# Altium schematic sheet smoothieboard-alt-p3.SchDoc: =ProjectTitle
size B; Organization: Altium Limited; Address1: L3, 12a Rodborough Rd; Address2: Frenchs Forest; Address3: NSW; Address4: Australia 2086; DocumentNumber: 4; SheetNumber: 4; SheetTotal: 6
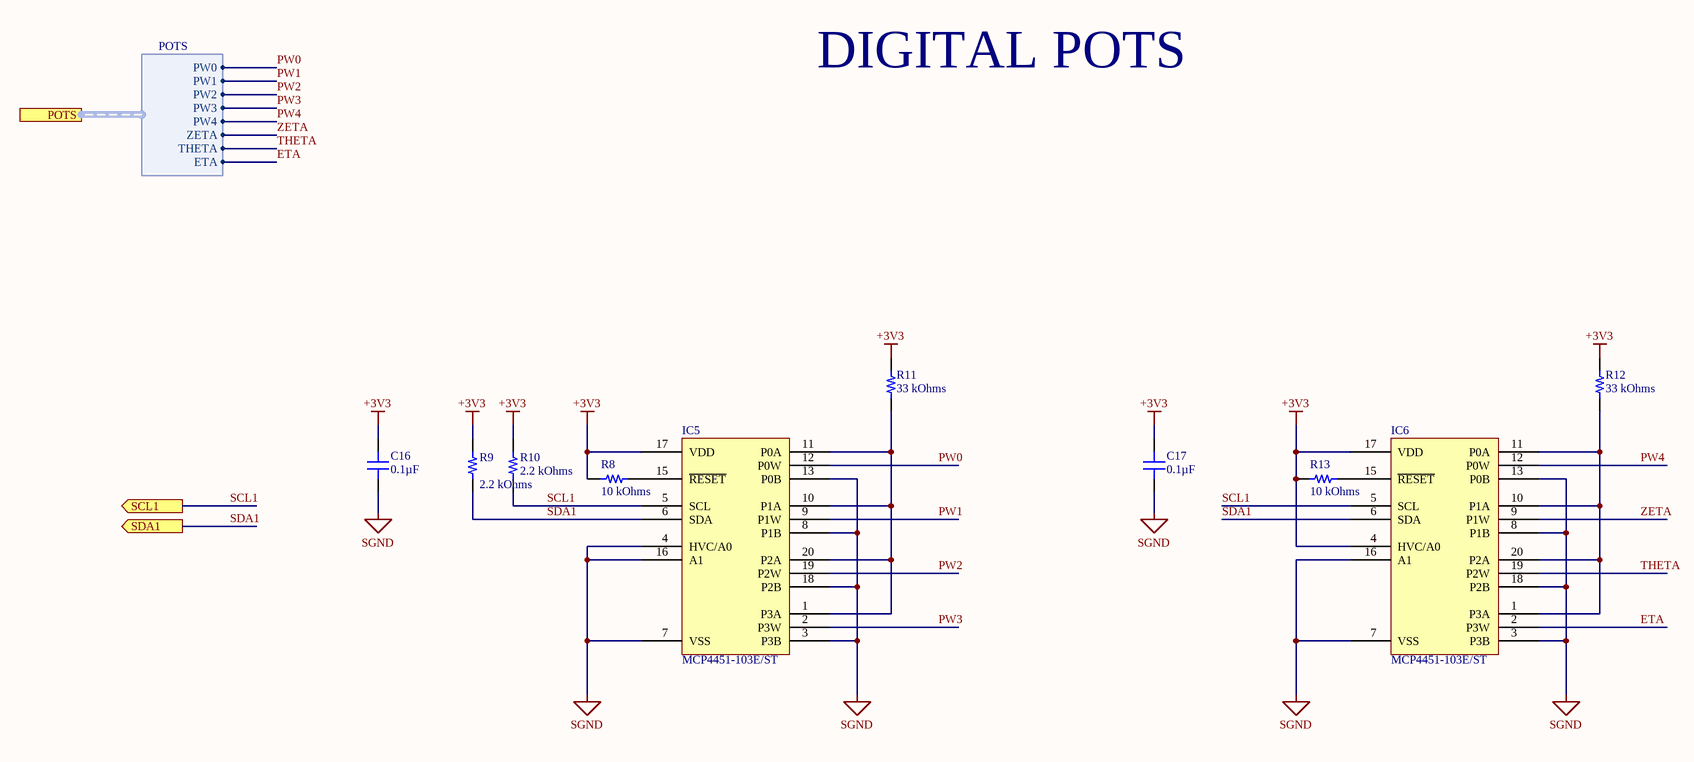
[diagram p0: smoothieboard-alt-p3.SchDoc]

## Parts
C16  0.1µF  [CAP 0402_1005]
C17  0.1µF  [CAP 0402_1005]
IC5  MCP4451-103E/ST  [MICROCHIP TSSOP-20 4.4MM BODY]
IC6  MCP4451-103E/ST  [MICROCHIP TSSOP-20 4.4MM BODY]
R8  10 kOhms  [RES 0402_1005]
R9  2.2 kOhms  [RES 0402_1005]
R10  2.2 kOhms  [RES 0402_1005]
R11  33 kOhms  [RES 0402_1005]
R12  33 kOhms  [RES 0402_1005]
R13  10 kOhms  [RES 0402_1005]

## Ports
POTS (harness POTS), SCL1 (out), SDA1 (out)

## Harnesses
POTS: PW0, PW1, PW2, PW3, PW4, ZETA, THETA, ETA

## Nets
+3V3: C16.2 C17.2 IC5.17(VDD) IC6.4(HVC/A0) IC6.17(VDD) R8.2 R9.2 R10.2 R11.2 R12.2 R13.2
SGND: C16.1 C17.1 IC5.3(P3B) IC5.4(HVC/A0) IC5.7(VSS) IC5.8(P1B) IC5.13(P0B) IC5.16(A1) IC5.18(P2B) IC6.3(P3B) IC6.7(VSS) IC6.8(P1B) IC6.13(P0B) IC6.16(A1) IC6.18(P2B)
ETA: IC6.2(P3W) ; port POTS.ETA
PW0: IC5.12(P0W) ; port POTS.PW0
PW1: IC5.9(P1W) ; port POTS.PW1
PW2: IC5.19(P2W) ; port POTS.PW2
PW3: IC5.2(P3W) ; port POTS.PW3
PW4: IC6.12(P0W) ; port POTS.PW4
SCL1: IC5.5(SCL) IC6.5(SCL) R10.1 ; port SCL1
SDA1: IC5.6(SDA) IC6.6(SDA) R9.1 ; port SDA1
THETA: IC6.19(P2W) ; port POTS.THETA
ZETA: IC6.9(P1W) ; port POTS.ZETA
NetIC5_1: IC5.1(P3A) IC5.10(P1A) IC5.11(P0A) IC5.20(P2A) R11.1
NetIC5_15: IC5.15(~{RESET}) R8.1
NetIC6_1: IC6.1(P3A) IC6.10(P1A) IC6.11(P0A) IC6.20(P2A) R12.1
NetIC6_15: IC6.15(~{RESET}) R13.1

## Notes on the sheet
- DIGITAL POTS
- Title
- Size:
- Date:
- B
- Number:
- Time:
- Revision:
- Sheet
- of
- File:

## Library data of the parts
C16 C17 = CC0402MRX5R5BB104: CAP CER 0.1UF 6.3V X5R 0402; Manufacturer: Yageo; Tolerance: ±20%; Part Number: CC0402MRX5R5BB104; Value: 0.1µF; Applications: General Purpose; Capacitance: 0.1µF; ComponentLink1Description: Datasheet; ComponentLink1URL: https://www.yageo.com/upload/media/product/productsearch/datasheet/mlcc/UPY-GPHC_X5R_4V-to-50V_25.pdf; ComponentLink2Description: DigiKey Link; ComponentLink2URL: http://digikey.com/product-detail/en/yageo/CC0402MRX5R5BB104/311-3818-1-ND/8024907; Device Package: 0402 (1005 Metric); LastUpdated: 9/2/2020 01:02:24; Lifecycle Status: Active; Minimum Order: 1; Mounting Type: Surface Mount, MLCC; Operating Temperature: -55°C ~ 85°C; Package / Case: 0402 (1005 Metric); Packaging: CutTape; PartId: 1960; Part Status: Active; Price: 0.10; Series: CC; Size / Dimension: 0.039" L x 0.020" W (1.00mm x 0.50mm); Supplier 1: DigiKey; Supplier Part Number 1: 311-3818-1-ND; Temperature Coefficient: X5R; Thickness (Max): 0.022" (0.55mm); Voltage - Rated: 6.3V
IC5 IC6 = MCP4451-103E/ST: IC DGT POT 10KOHM 257TAP 20TSSOP; Manufacturer: Microchip Technology; Configuration: Potentiometer; Interface: I²C; Memory Type: Volatile; Number of Circuits: 4; Number of Taps: 257; Resistance (Ohms): 10k; Resistance - Wiper (Ohms) (Typ): 75; Temperature Coefficient (Typ): 150ppm/°C; Tolerance: ±20%; Voltage - Supply: 1.8V ~ 5.5V; Part Number: MCP4451-103E/ST; ComponentLink1Description: Datasheet; ComponentLink1URL: http://www.microchip.com/mymicrochip/filehandler.aspx?ddocname=en551978; ComponentLink2Description: DigiKey Link; ComponentLink2URL: //digikey.com/product-detail/en/microchip-technology/MCP4451-103E-ST/MCP4451-103E-ST-ND/2601449; Device Package: 20-TSSOP (0.173", 4.40mm Width); Features: Mute, Selectable Address; LastUpdated: 12/4/2019 00:36:58; Lifecycle Status: 0; Minimum Order: 1; Operating Temperature: -40°C ~ 125°C; Package / Case: 20-TSSOP (0.173", 4.40mm Width); Packaging: Tube; PartId: 1; Part Status: Active; Price: 1.35; Series: -; Supplier 1: DigiKey; Supplier Part Number 1: MCP4451-103E/ST-ND; Supplier Device Package: 20-TSSOP; Taper: Linear
R8 R13 = CRCW040210K0JNTD: RES SMD 10K OHM 5% 1/16W 0402; Manufacturer: Vishay Dale; Power (Watts): 0.063W, 1/16W; Temperature Coefficient: ±200ppm/°C; Part Number: CRCW040210K0JNTD; Value: 10 kOhms; ComponentLink1Description: Datasheet; ComponentLink1URL: http://www.vishay.com/docs/20008/dcrcw.pdf; ComponentLink2Description: DigiKey Link; ComponentLink2URL: http://digikey.com/product-detail/en/vishay-dale/CRCW040210K0JNTD/541-CRCW040210K0JNTDCT-ND/11501263; Composition: Thick Film; Device Package: 0402 (1005 Metric); Features: Automotive AEC-Q200; LastUpdated: 9/2/2020 01:07:22; Lifecycle Status: Active; Minimum Order: 1; Number of Terminations: 2; Operating Temperature: -55°C ~ 155°C; Package / Case: 0402 (1005 Metric); Packaging: TapeAndReel; PartId: 56880; Price: 0.01; Ratings: AEC-Q200; Resistance: 10 kOhms; Series: CRCW; Supplier 1: DigiKey; Supplier Part Number 1: 541-CRCW040210K0JNTDCT-ND; Supplier Device Package: 0402; Tolerance: ±5%
R9 R10 = SR0402FR-7T2K2L: RES SMD 0402 1/5W 1% 2.2K OHM; Manufacturer: Yageo; Power (Watts): 0.2W, 1/5W; Temperature Coefficient: ±200ppm/°C; Part Number: SR0402FR-7T2K2L; Value: 2.2 kOhms; ComponentLink1Description: Datasheet; ComponentLink1URL: http://www.yageo.com/documents/recent/PYu-SR_D_F%20tol_RoHS_L_4.pdf; ComponentLink2Description: DigiKey Link; ComponentLink2URL: http://digikey.com/product-detail/en/yageo/SR0402FR-7T2K2L/YAG5818CT-ND/9373203; Composition: Thick Film; Device Package: 0402 (1005 Metric); Features: Automotive AEC-Q200, Pulse Withstanding; Height - Seated (Max): 0.016" (0.40mm); LastUpdated: 9/2/2020 01:08:07; Lifecycle Status: Active; Minimum Order: 1; Number of Terminations: 2; Operating Temperature: -55°C ~ 155°C; Package / Case: 0402 (1005 Metric); Packaging: TapeAndReel; PartId: 4414; Part Status: Active; Price: 0.11; Ratings: AEC-Q200; Resistance: 2.2 kOhms; Series: SR; Size / Dimension: 0.039" L x 0.020" W (1.00mm x 0.50mm); Supplier 1: DigiKey; Supplier Part Number 1: YAG5818CT-ND; Supplier Device Package: 0402; Tolerance: ±1%
R11 R12 = RT0402FRE0733KL: RES SMD 33K OHM 1% 1/16W 0402; Manufacturer: Yageo; Power (Watts): 0.063W, 1/16W; Temperature Coefficient: ±50ppm/°C; Part Number: RT0402FRE0733KL; Value: 33 kOhms; ComponentLink1Description: Datasheet; ComponentLink1URL: https://www.yageo.com/upload/media/product/productsearch/datasheet/rchip/PYu-RT_1-to-0.01_RoHS_L_11.pdf; ComponentLink2Description: DigiKey Link; ComponentLink2URL: http://digikey.com/product-detail/en/yageo/RT0402FRE0733KL/YAG5933CT-ND/9370963; Composition: Thin Film; Device Package: 0402 (1005 Metric); Height - Seated (Max): 0.014" (0.35mm); LastUpdated: 9/2/2020 01:07:32; Lifecycle Status: Active; Minimum Order: 1; Number of Terminations: 2; Operating Temperature: -55°C ~ 155°C; Package / Case: 0402 (1005 Metric); Packaging: TapeAndReel; PartId: 19353; Part Status: Active; Price: 0.01; Resistance: 33 kOhms; Series: RT; Size / Dimension: 0.039" L x 0.020" W (1.00mm x 0.50mm); Supplier 1: DigiKey; Supplier Part Number 1: YAG5933CT-ND; Supplier Device Package: 0402; Tolerance: ±1%